# Altium project board_stm32h7.PrjPCB
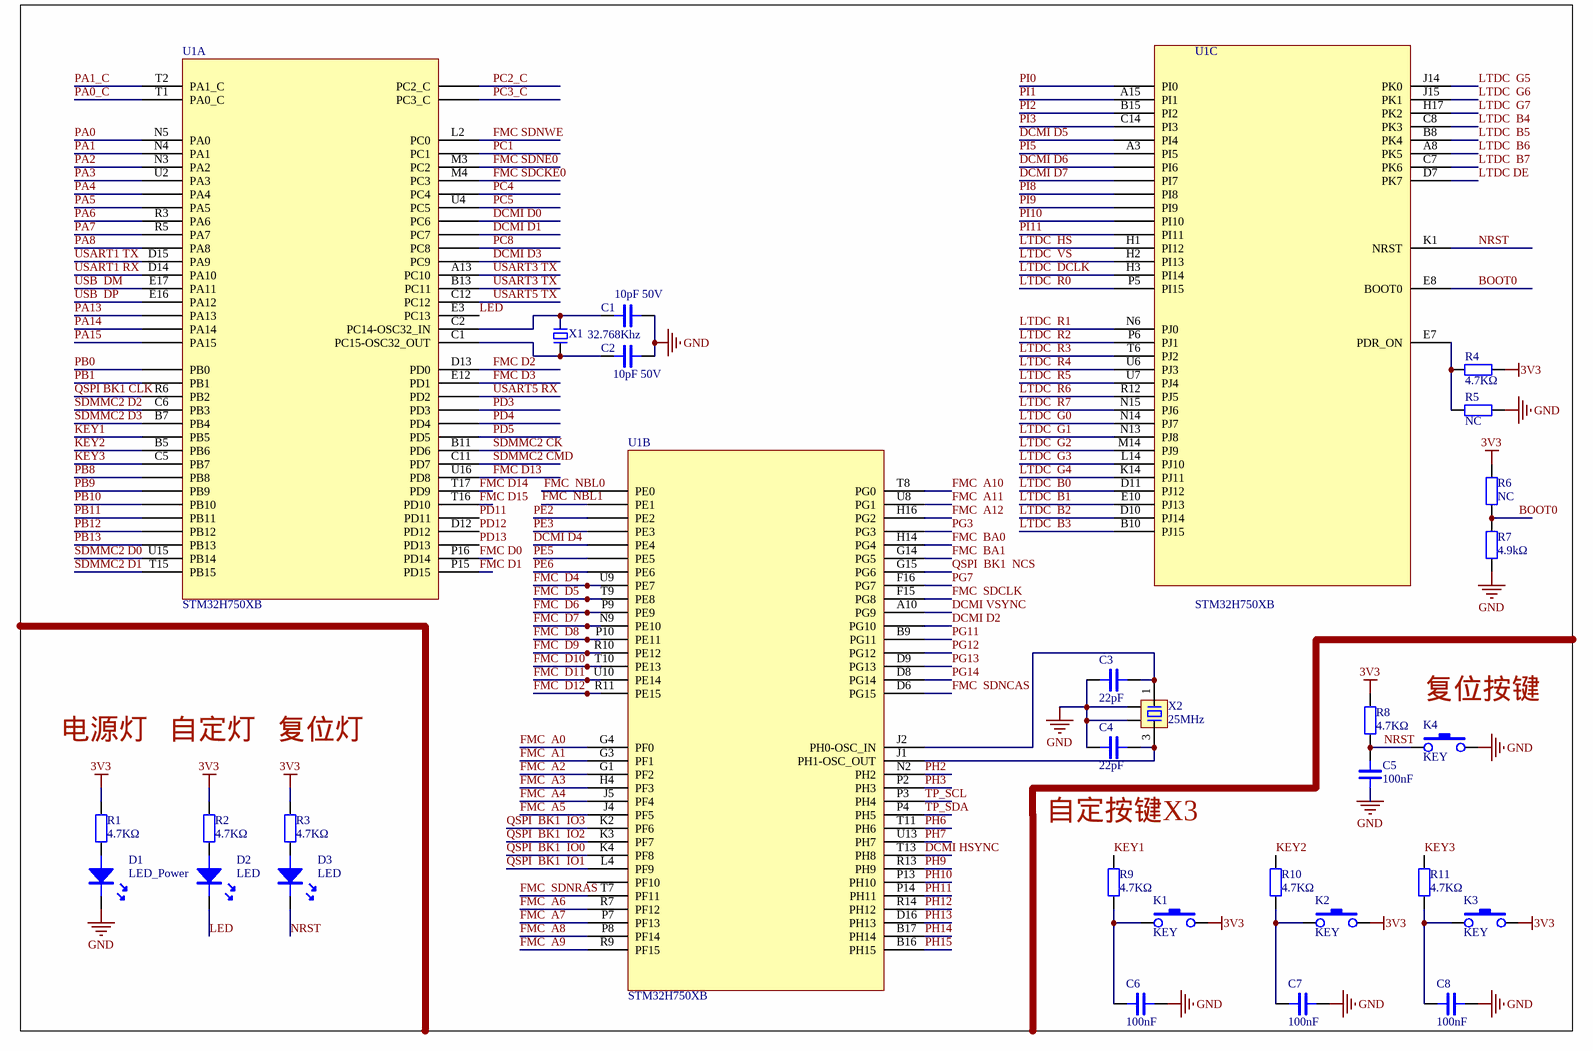
[diagram p0: STM32_PINS.SchDoc]
5 sheets, 109 parts. Net scope: global (net labels, ports and power ports of the same name join across sheets).
Board file: board_PCB.PcbDoc
Sheets:
  STM32_PINS.SchDoc
  stm32_vcc.SchDoc
  LCD.SchDoc
  Store.SchDoc
  INTERFACE.SchDoc

## Sheet STM32_PINS.SchDoc
size A4

### Parts
C1  10pF 50V  [0805C]
C2  10pF 50V  [0805C]
C3  22pF  [0805C]
C4  22pF  [0805C]
C5  100nF  [0805C]
C6  100nF  [0805C]
C7  100nF  [0805C]
C8  100nF  [0805C]
D1  LED_Power  [LED5-BLUE]
D2  LED  [LED5-BLUE]
D3  LED  [LED5-BLUE]
K1  KEY  [DIP-3X6X4.3]
K2  KEY  [DIP-3X6X4.3]
K3  KEY  [DIP-3X6X4.3]
K4  KEY  [DIP-3X6X4.3]
R1  4.7KΩ  [0805]
R2  4.7KΩ  [0805]
R3  4.7KΩ  [0805]
R4  4.7KΩ  [0805]
R5  NC  [0805]
R6  NC  [0805]
R7  4.9kΩ  [0805]
R8  4.7KΩ  [0805]
R9  4.7KΩ  [0805]
R10  4.7KΩ  [0805]
R11  4.7KΩ  [0805]
U1  STM32H750XB  [BGA265C80P17X17_1400X1400X110]  (parts A,B,C of 4)
X1  32.768Khz  [OSC HC-49S]
X2  25MHz  [OSC 1612-4P]

### Nets
3V3: K1.3 K2.3 K3.3 R1.2 R2.2 R3.2 R4.2 R6.2 R8.2
GND: C1.2 C2.1 C3.2 C4.2 C5.2 C6.1 C7.1 C8.1 D1.K K4.3 R5.2 R7.1 X2.2 X2.4  [project net LEDA]
BOOT0: R6.1 R7.2 U1.E8(BOOT0)
DCMI D0: U1.?18(PC6)
DCMI D1: U1.?19(PC7)
DCMI D2: U1.?10(PG10)
DCMI D3: U1.?21(PC9)
DCMI D4: U1.?5(PE4)
DCMI D5: U1.?2(PI4)
DCMI D6: U1.?3(PI6)
DCMI D7: U1.?4(PI7)
DCMI HSYNC: U1.T13(PH8)
DCMI VSYNC: U1.A10(PG9)
FMC  A0: U1.G4(PF0)
FMC  A1: U1.G3(PF1)
FMC  A2: U1.G1(PF2)
FMC  A3: U1.H4(PF3)
FMC  A4: U1.J5(PF4)
FMC  A5: U1.J4(PF5)
FMC  A6: U1.R7(PF12)
FMC  A7: U1.P7(PF13)
FMC  A8: U1.P8(PF14)
FMC  A9: U1.R9(PF15)
FMC  A10: U1.T8(PG0)
FMC  A11: U1.U8(PG1)
FMC  A12: U1.H16(PG2)
FMC  BA0: U1.H14(PG4)
FMC  BA1: U1.G14(PG5)
FMC  D4: U1.U9(PE7)
FMC  D5: U1.T9(PE8)
FMC  D6: U1.P9(PE9)
FMC  D7: U1.N9(PE10)
FMC  D8: U1.P10(PE11)
FMC  D9: U1.R10(PE12)
FMC  D10: U1.T10(PE13)
FMC  D11: U1.U10(PE14)
FMC  D12: U1.R11(PE15)
FMC  NBL0: U1.?1(PE0)
FMC  SDCLK: U1.F15(PG8)
FMC  SDNCAS: U1.D6(PG15)
FMC  SDNRAS: U1.T7(PF11)
FMC D0: U1.P16(PD14)
FMC D1: U1.P15(PD15)
FMC D2: U1.D13(PD0)
FMC D3: U1.E12(PD1)
FMC D13: U1.U16(PD8)
FMC D14: U1.T17(PD9)
FMC D15: U1.T16(PD10)
FMC SDCKE0: U1.M4(PC3)
FMC SDNE0: U1.M3(PC2)
FMC SDNWE: U1.L2(PC0)
KEY1: R9.1 U1.?9(PB5)
KEY2: R10.1 U1.B5(PB6)
KEY3: R11.1 U1.C5(PB7)
LED: D2.K U1.E3(PC13)
LTDC  B0: U1.D11(PJ12)
LTDC  B1: U1.E10(PJ13)
LTDC  B2: U1.D10(PJ14)
LTDC  B3: U1.B10(PJ15)
LTDC  B4: U1.C8(PK3)
LTDC  B5: U1.B8(PK4)
LTDC  B6: U1.A8(PK5)
LTDC  B7: U1.C7(PK6)
LTDC  DCLK: U1.H3(PI14)
LTDC  G0: U1.N14(PJ7)
LTDC  G1: U1.N13(PJ8)
LTDC  G2: U1.M14(PJ9)
LTDC  G3: U1.L14(PJ10)
LTDC  G4: U1.K14(PJ11)
LTDC  G5: U1.J14(PK0)
LTDC  G6: U1.J15(PK1)
LTDC  G7: U1.H17(PK2)
LTDC  HS: U1.H1(PI12)
LTDC  R0: U1.P5(PI15)
LTDC  R1: U1.N6(PJ0)
LTDC  R2: U1.P6(PJ1)
LTDC  R3: U1.T6(PJ2)
LTDC  R4: U1.U6(PJ3)
LTDC  R5: U1.U7(PJ4)
LTDC  R6: U1.R12(PJ5)
LTDC  R7: U1.N15(PJ6)
LTDC  VS: U1.H2(PI13)
LTDC DE: U1.D7(PK7)
NRST: C5.1 D3.K K4.1 R8.1 U1.K1(NRST)
PA0: U1.N5(PA0)
PA0_C: U1.T1(PA0_C)
PA1: U1.N4(PA1)
PA1_C: U1.T2(PA1_C)
PA2: U1.N3(PA2)
PA3: U1.U2(PA3)
PA4: U1.?1(PA4)
PA5: U1.?2(PA5)
PA6: U1.R3(PA6)
PA7: U1.R5(PA7)
PA8: U1.?3(PA8)
PA13: U1.?4(PA13)
PA14: U1.?5(PA14)
PA15: U1.?6(PA15)
PB0: U1.?7(PB0)
PB1: U1.?8(PB1)
PB8: U1.?10(PB8)
PB9: U1.?11(PB9)
PB10: U1.?12(PB10)
PB11: U1.?13(PB11)
PB12: U1.?14(PB12)
PB13: U1.?15(PB13)
PC1: U1.?16(PC1)
PC2_C: U1.?28(PC2_C)
PC3_C: U1.?29(PC3_C)
PC4: U1.?17(PC4)
PC5: U1.U4(PC5)
PC8: U1.?20(PC8)
PD3: U1.?23(PD3)
PD4: U1.?24(PD4)
PD5: U1.?25(PD5)
PD11: U1.?26(PD11)
PD12: U1.D12(PD12)
PD13: U1.?27(PD13)
PE2: U1.?3(PE2)
PE3: U1.?4(PE3)
PE5: U1.?6(PE5)
PE6: U1.?7(PE6)
PG3: U1.?9(PG3)
PG7: U1.F16(PG7)
PG11: U1.B9(PG11)
PG12: U1.?11(PG12)
PG13: U1.D9(PG13)
PG14: U1.D8(PG14)
PH2: U1.N2(PH2)
PH3: U1.P2(PH3)
PH6: U1.T11(PH6)
PH7: U1.U13(PH7)
PH9: U1.R13(PH9)
PH10: U1.P13(PH10)
PH11: U1.P14(PH11)
PH12: U1.R14(PH12)
PH13: U1.D16(PH13)
PH14: U1.B17(PH14)
PH15: U1.B16(PH15)
PI0: U1.?1(PI0)
PI1: U1.A15(PI1)
PI2: U1.B15(PI2)
PI3: U1.C14(PI3)
PI5: U1.A3(PI5)
PI8: U1.?5(PI8)
PI9: U1.?6(PI9)
PI10: U1.?7(PI10)
PI11: U1.?8(PI11)
QSPI  BK1  IO0: U1.K4(PF8)
QSPI  BK1  IO1: U1.L4(PF9)
QSPI  BK1  IO2: U1.K3(PF7)
QSPI  BK1  IO3: U1.K2(PF6)
QSPI  BK1  NCS: U1.G15(PG6)
QSPI BK1 CLK: U1.R6(PB2)
SDMMC2 CK: U1.B11(PD6)
SDMMC2 CMD: U1.C11(PD7)
SDMMC2 D0: U1.U15(PB14)
SDMMC2 D1: U1.T15(PB15)
SDMMC2 D2: U1.C6(PB3)
SDMMC2 D3: U1.B7(PB4)
TP_SCL: U1.P3(PH4)
TP_SDA: U1.P4(PH5)
USART1 RX: U1.D14(PA10)
USART1 TX: U1.D15(PA9)
USART3 TX: U1.A13(PC10) U1.B13(PC11)
USART5 RX: U1.?22(PD2)
USART5 TX: U1.C12(PC12)
USB  DM: U1.E17(PA11)
USB  DP: U1.E16(PA12)
NetC1_1: C1.1 U1.C2(PC14-OSC32_IN) X1.2
NetC2_2: C2.2 U1.C1(PC15-OSC32_OUT) X1.1
NetC3_1: C3.1 U1.J2(PH0-OSC_IN) X2.1
NetC4_1: C4.1 U1.J1(PH1-OSC_OUT) X2.3
NetC6_2: C6.2 K1.1 R9.2
NetC7_2: C7.2 K2.1 R10.2
NetC8_2: C8.2 K3.1 R11.2
NetR4_1: R4.1 R5.1 U1.E7(PDR_ON)

Not connected (* = marked no-connect by the designer): D1 A; D2 A; D3 A; R1 1; R2 1; R3 1

### Notes on the sheet
- 复位按键
- 电源灯
- 自定灯
- 复位灯
- 自定按键X3
- Labels drawn without touching a wire or pin: FMC  NBL1

### Library data of the parts
C1-C8 = CAP: Capacitor
D1 = LED
R1-R11 = RES: Resistor
X1 = XTAL-2P: 2脚无源脚晶振
X2 = XTAL-4P: 4脚无源晶振

## Sheet stm32_vcc.SchDoc
size A4
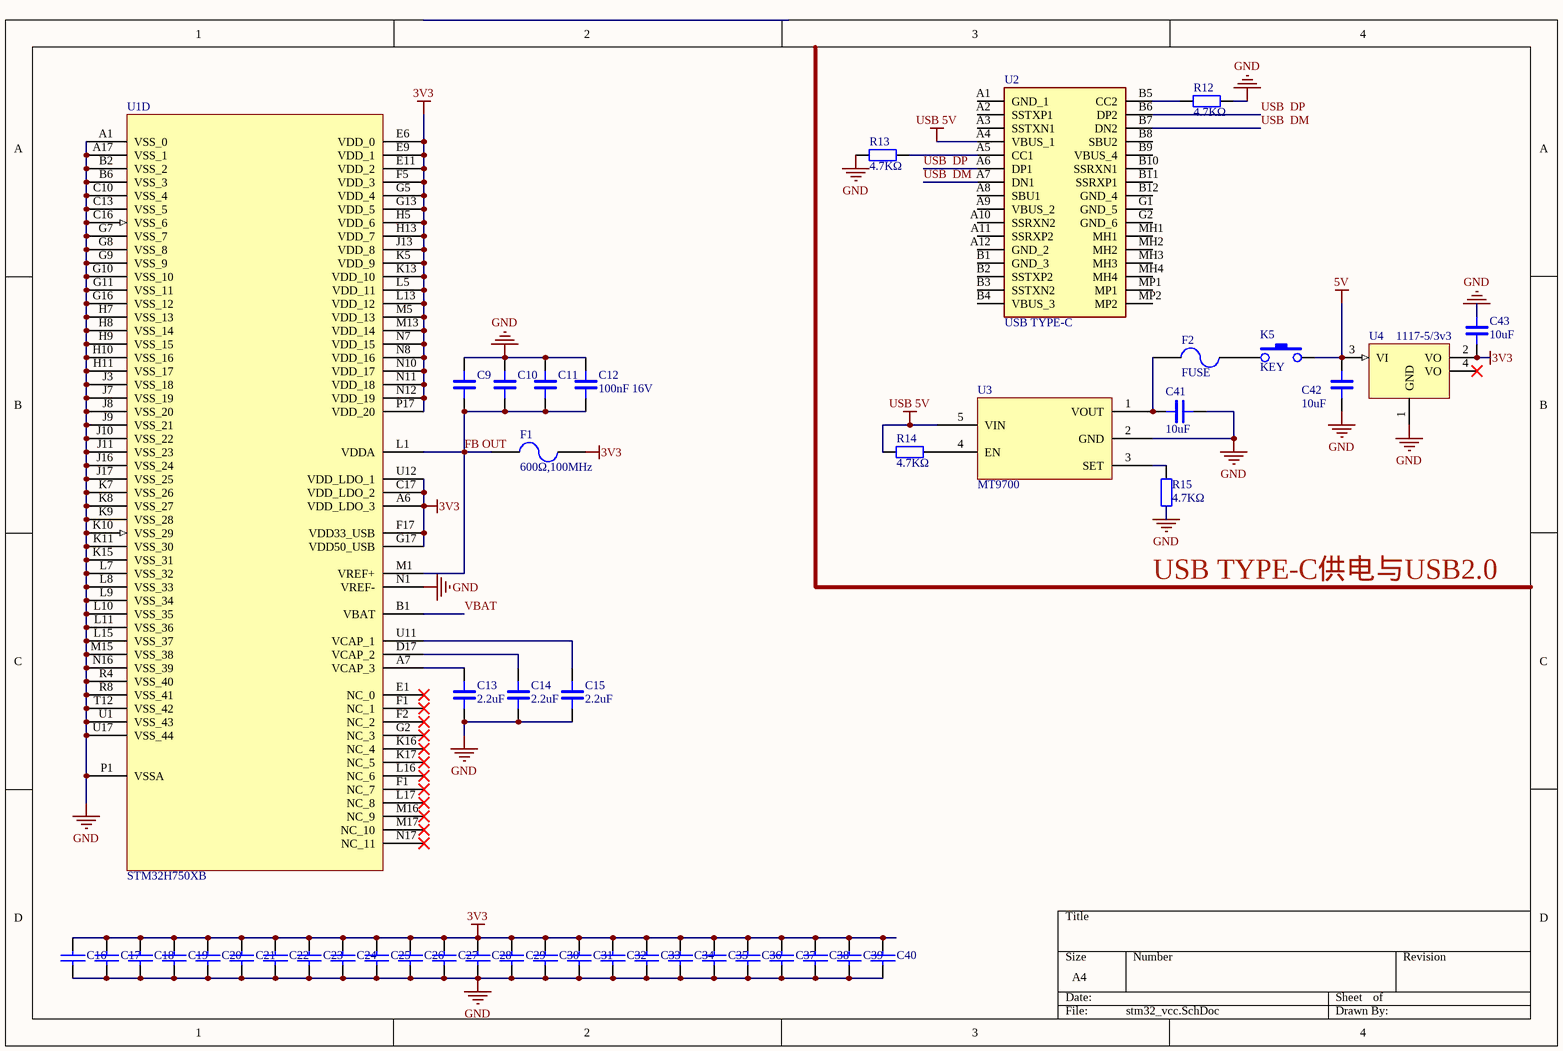
[diagram p1: stm32_vcc.SchDoc]

### Parts
C9  100nF 16V  [0805]  (value not drawn)
C10  100nF 16V  [0805]  (value not drawn)
C11  100nF 16V  [0805]  (value not drawn)
C12  100nF 16V  [0805]
C13  2.2uF  [0805]
C14  2.2uF  [0805]
C15  2.2uF  [0805]
C16  104 16V  [0805C]  (value not drawn)
C17  104 16V  [0805C]  (value not drawn)
C18  104 16V  [0805C]  (value not drawn)
C19  104 16V  [0805C]  (value not drawn)
C20  104 16V  [0805C]  (value not drawn)
C21  104 16V  [0805C]  (value not drawn)
C22  104 16V  [0805C]  (value not drawn)
C23  104 16V  [0805C]  (value not drawn)
C24  104 16V  [0805C]  (value not drawn)
C25  104 16V  [0805C]  (value not drawn)
C26  104 16V  [0805C]  (value not drawn)
C27  104 16V  [0805C]  (value not drawn)
C28  104 16V  [0805C]  (value not drawn)
C29  104 16V  [0805C]  (value not drawn)
C30  104 16V  [0805C]  (value not drawn)
C31  104 16V  [0805C]  (value not drawn)
C32  104 16V  [0805C]  (value not drawn)
C33  104 16V  [0805C]  (value not drawn)
C34  104 16V  [0805C]  (value not drawn)
C35  104 16V  [0805C]  (value not drawn)
C36  104 16V  [0805C]  (value not drawn)
C37  104 16V  [0805C]  (value not drawn)
C38  104 16V  [0805C]  (value not drawn)
C39  104 16V  [0805C]  (value not drawn)
C40  104 16V  [0805C]  (value not drawn)
C41  10uF  [0805]
C42  10uF  [0805]
C43  10uF  [CAP-0805]
F1  600Ω,100MHz  [FUSE-1210]
F2  FUSE  [FUSE-1210]
K5  KEY  [DIP-3X6X4.3]
R12  4.7KΩ  [0805]
R13  4.7KΩ  [0805]
R14  4.7KΩ  [0805]
R15  4.7KΩ  [0805]
U1  STM32H750XB  [BGA265C80P17X17_1400X1400X110]  (part D of 4)
U2  USB TYPE-C  [632723100011]
U3  MT9700  [SOT-23-5]
U4  1117-5/3v3  [SOT-23]

### Nets
3V3: C16.2 C17.2 C18.2 C19.2 C20.2 C21.2 C22.2 C23.2 C24.2 C25.2 C26.2 C27.2 C28.2 C29.2 C30.2 C31.2 C32.2 C33.2 C34.2 C35.2 C36.2 C37.2 C38.2 C39.2 C40.2 C43.2 F1.2 U1.A6(VDD_LDO_3) U1.C17(VDD_LDO_2) U1.E6(VDD_0) U1.E9(VDD_1) U1.E11(VDD_2) U1.F5(VDD_3) U1.F17(VDD33_USB) U1.G5(VDD_4) U1.G13(VDD_5) U1.G17(VDD50_USB) U1.H5(VDD_6) U1.H13(VDD_7) U1.J13(VDD_8) U1.K5(VDD_9) U1.K13(VDD_10) U1.L5(VDD_11) U1.L13(VDD_12) U1.M5(VDD_13) U1.M13(VDD_14) U1.N7(VDD_15) U1.N8(VDD_16) U1.N10(VDD_17) U1.N11(VDD_18) U1.N12(VDD_19) U1.P17(VDD_20) U1.U12(VDD_LDO_1) U4.2(VO)
5V: C42.1 K5.3 U4.3(VI)
GND: C9.2 C10.2 C11.2 C12.2 C13.1 C14.1 C15.1 C16.1 C17.1 C18.1 C19.1 C20.1 C21.1 C22.1 C23.1 C24.1 C25.1 C26.1 C27.1 C28.1 C29.1 C30.1 C31.1 C32.1 C33.1 C34.1 C35.1 C36.1 C37.1 C38.1 C39.1 C40.1 C41.1 C42.2 C43.1 R12.1 R13.2 R15.2 U1.A1(VSS_0) U1.A17(VSS_1) U1.B2(VSS_2) U1.B6(VSS_3) U1.C10(VSS_4) U1.C13(VSS_5) U1.C16(VSS_6) U1.G7(VSS_7) U1.G8(VSS_8) U1.G9(VSS_9) U1.G10(VSS_10) U1.G11(VSS_11) U1.G16(VSS_12) U1.H7(VSS_13) U1.H8(VSS_14) U1.H9(VSS_15) U1.H10(VSS_16) U1.H11(VSS_17) U1.J3(VSS_18) U1.J7(VSS_19) U1.J8(VSS_20) U1.J9(VSS_21) U1.J10(VSS_22) U1.J11(VSS_23) U1.J16(VSS_24) U1.J17(VSS_25) U1.K7(VSS_26) U1.K8(VSS_27) U1.K9(VSS_28) U1.K10(VSS_29) U1.K11(VSS_30) U1.K15(VSS_31) U1.L7(VSS_32) U1.L8(VSS_33) U1.L9(VSS_34) U1.L10(VSS_35) U1.L11(VSS_36) U1.L15(VSS_37) U1.M15(VSS_38) U1.N1(VREF-) U1.N16(VSS_39) U1.P1(VSSA) U1.R4(VSS_40) U1.R8(VSS_41) U1.T12(VSS_42) U1.U1(VSS_43) U1.U17(VSS_44) U3.2(GND) U4.1(GND)  [project net LEDA]
USB 5V: R14.2 U2.A4(VBUS_1) U3.5(VIN)
FB OUT: C9.1 C10.1 C11.1 C12.1 F1.1 U1.L1(VDDA) U1.M1(VREF+)
USB  DM: U2.A7(DN1) U2.B7(DN2)
USB  DP: U2.A6(DP1) U2.B6(DP2)
VBAT: U1.B1(VBAT)
NetC13_2: C13.2 U1.A7(VCAP_3)
NetC14_2: C14.2 U1.D17(VCAP_2)
NetC15_2: C15.2 U1.U11(VCAP_1)
NetC41_2: C41.2 F2.1 U3.1(VOUT)
NetF2_2: F2.2 K5.1
NetR12_2: R12.2 U2.B5(CC2)
NetR13_1: R13.1 U2.A5(CC1)
NetR14_1: R14.1 U3.4(EN)
NetR15_1: R15.1 U3.3(SET)

Not connected (* = marked no-connect by the designer): U1 E1(NC_0)* F1(NC_1)* F2(NC_2)* G2(NC_3)* K16(NC_4)* K17(NC_5)* L16(NC_6)* L17(NC_8)* M16(NC_9)* M17(NC_10)* N17(NC_11)*; U2 A1(GND_1) A2(SSTXP1) A3(SSTXN1) A8(SBU1) A9(VBUS_2) A10(SSRXN2) A11(SSRXP2) A12(GND_2) B1(GND_3) B2(SSTXP2) B3(SSTXN2) B4(VBUS_3) B8(SBU2) B9(VBUS_4) B10(SSRXN1) B11(SSRXP1) B12(GND_4) G1(GND_5) G2(GND_6) MH1 MH2 MH3 MH4 MP1 MP2; U4 4(VO)*

### Notes on the sheet
- (near R15) USB TYPE-C供电与USB2.0

### Library data of the parts
C9-C15 C41-C43 = CAP: Capacitor
C16-C40 = CAP: 无极性电容
F1 = FUSE
F2 = FUSE: 1000mA
R12-R15 = RES: Resistor
U2 = 632723100011: Integrated Circuit; Manufacturer_Name: Wurth Elektronik; Datasheet Link: https://componentsearchengine.com/Datasheets/1/632723100011.pdf; Height: 3.11mm; Manufacturer_Part_Number: 632723100011; Mouser Part Number: 710-632723100011; Mouser Price/Stock: https://www.mouser.co.uk/ProductDetail/Wurth-Elektronik/632723100011?qs=NK6InXoXhq4o62C9ULXLjQ%3D%3D
U4 = 1117: Linear Regulator

## Sheet LCD.SchDoc
size A4
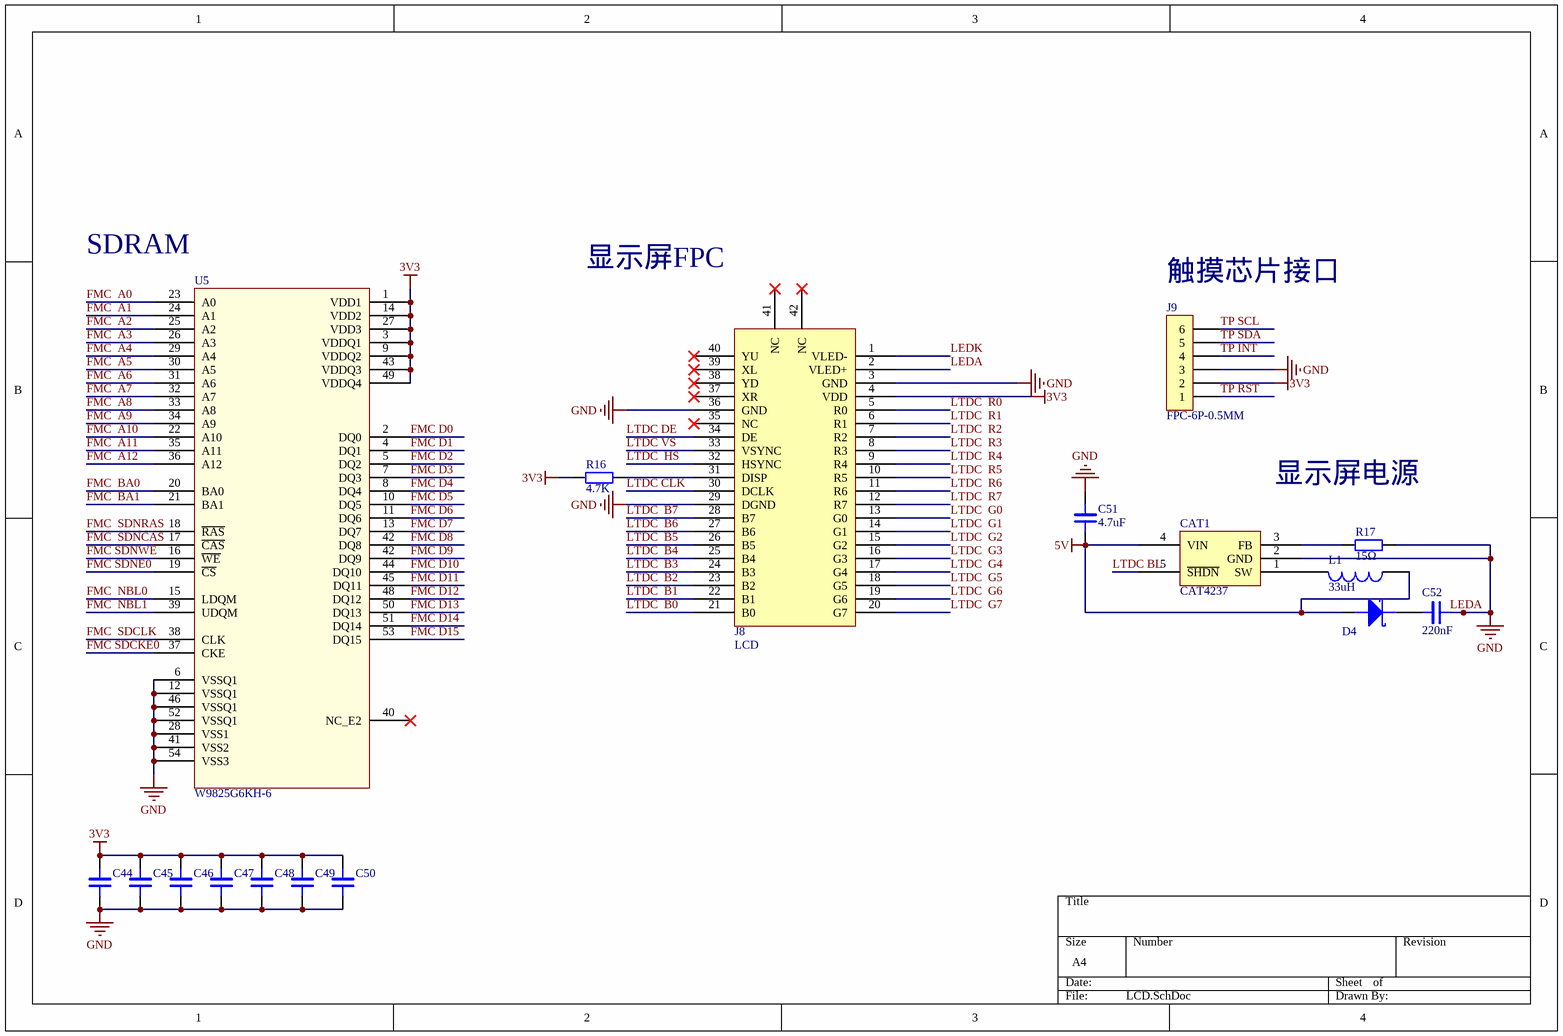
[diagram p2: LCD.SchDoc]

### Parts
C44  100nF 16V  [0805]  (value not drawn)
C45  100nF 16V  [0805]  (value not drawn)
C46  100nF 16V  [0805]  (value not drawn)
C47  100nF 16V  [0805]  (value not drawn)
C48  100nF 16V  [0805]  (value not drawn)
C49  100nF 16V  [0805]  (value not drawn)
C50  100nF 16V  [0805]  (value not drawn)
C51  4.7uF  [CAP-1812]
C52  220nF  [CAP-1812]
CAT1  CAT4237  [SOT-23-5]
D4  (no value)  [DO-15]
J8  LCD
J9  FPC-6P-0.5MM  [Pin HDR1X6/2.54mm-S]
L1  33uH  [AL0204]
R16  4.7K  [0805]
R17  15Ω  [0805]
U5  W9825G6KH-6

### Nets
3V3: C44.2 C45.2 C46.2 C47.2 C48.2 C49.2 C50.2 J8.4(VDD) J9.2 R16.1 U5.1(VDD1) U5.3(VDDQ1) U5.9(VDDQ2) U5.14(VDD2) U5.27(VDD3) U5.43(VDDQ3) U5.49(VDDQ4)
5V: C51.1 CAT1.4(VIN) D4.A L1.1
LEDA: C44.1 C45.1 C46.1 C47.1 C48.1 C49.1 C50.1 C51.2 C52.2 CAT1.2(GND) J8.2(VLED+) J8.3(GND) J8.29(DGND) J8.36(GND) J9.3 R17.2 U5.6(VSSQ1) U5.12(VSSQ1) U5.28(VSS1) U5.41(VSS2) U5.46(VSSQ1) U5.52(VSSQ1) U5.54(VSS3)  [also labelled GND]
FMC  A0: U5.23(A0)
FMC  A1: U5.24(A1)
FMC  A2: U5.25(A2)
FMC  A3: U5.26(A3)
FMC  A4: U5.29(A4)
FMC  A5: U5.30(A5)
FMC  A6: U5.31(A6)
FMC  A7: U5.32(A7)
FMC  A8: U5.33(A8)
FMC  A9: U5.34(A9)
FMC  A10: U5.22(A10)
FMC  A11: U5.35(A11)
FMC  A12: U5.36(A12)
FMC  BA0: U5.20(BA0)
FMC  BA1: U5.21(BA1)
FMC  NBL0: U5.15(LDQM)
FMC  NBL1: U5.39(UDQM)
FMC  SDCLK: U5.38(CLK)
FMC  SDNCAS: U5.17(~{CAS})
FMC  SDNRAS: U5.18(~{RAS})
FMC D0: U5.2(DQ0)
FMC D1: U5.4(DQ1)
FMC D2: U5.5(DQ2)
FMC D3: U5.7(DQ3)
FMC D4: U5.8(DQ4)
FMC D5: U5.10(DQ5)
FMC D6: U5.11(DQ6)
FMC D7: U5.13(DQ7)
FMC D8: U5.42(DQ8)
FMC D9: U5.42(DQ9)
FMC D10: U5.44(DQ10)
FMC D11: U5.45(DQ11)
FMC D12: U5.48(DQ12)
FMC D13: U5.50(DQ13)
FMC D14: U5.51(DQ14)
FMC D15: U5.53(DQ15)
FMC SDCKE0: U5.37(CKE)
FMC SDNE0: U5.19(~{CS})
FMC SDNWE: U5.16(~{WE})
LEDK: J8.1(VLED-)
LTDC  B0: J8.21(B0)
LTDC  B1: J8.22(B1)
LTDC  B2: J8.23(B2)
LTDC  B3: J8.24(B3)
LTDC  B4: J8.25(B4)
LTDC  B5: J8.26(B5)
LTDC  B6: J8.27(B6)
LTDC  B7: J8.28(B7)
LTDC  G0: J8.13(G0)
LTDC  G1: J8.14(G1)
LTDC  G2: J8.15(G2)
LTDC  G3: J8.16(G3)
LTDC  G4: J8.17(G4)
LTDC  G5: J8.18(G5)
LTDC  G6: J8.19(G6)
LTDC  G7: J8.20(G7)
LTDC  HS: J8.32(HSYNC)
LTDC  R0: J8.5(R0)
LTDC  R1: J8.6(R1)
LTDC  R2: J8.7(R2)
LTDC  R3: J8.8(R3)
LTDC  R4: J8.9(R4)
LTDC  R5: J8.10(R5)
LTDC  R6: J8.11(R6)
LTDC  R7: J8.12(R7)
LTDC BL: CAT1.5(~{SHDN})
LTDC CLK: J8.30(DCLK)
LTDC DE: J8.34(DE)
LTDC VS: J8.33(VSYNC)
TP INT: J9.4
TP RST: J9.1
TP SCL: J9.6
TP SDA: J9.5
NetC52_1: C52.1 D4.K
NetCAT1_1: CAT1.1(SW) L1.2
NetCAT1_3: CAT1.3(FB) R17.1
NetJ8_31: J8.31(DISP) R16.2

Not connected (* = marked no-connect by the designer): J8 35(NC)* 37(XR)* 38(YD)* 39(XL)* 40(YU)* 41(NC)* 42(NC)*; U5 40(NC_E2)*

### Notes on the sheet
- (near U5) SDRAM
- 显示屏FPC
- (near J9) 触摸芯片接口
- 显示屏电源

### Library data of the parts
C44-C52 = CAP: Capacitor
D4 = DIODE SCHOTTKY: 肖特基二极管
J8 = LCD: FPC 接线口0.5mm 40Pins
J9 = Pin HDR1X6
L1 = INDUCTOR
R16 R17 = RES: Resistor

## Sheet Store.SchDoc
size A4
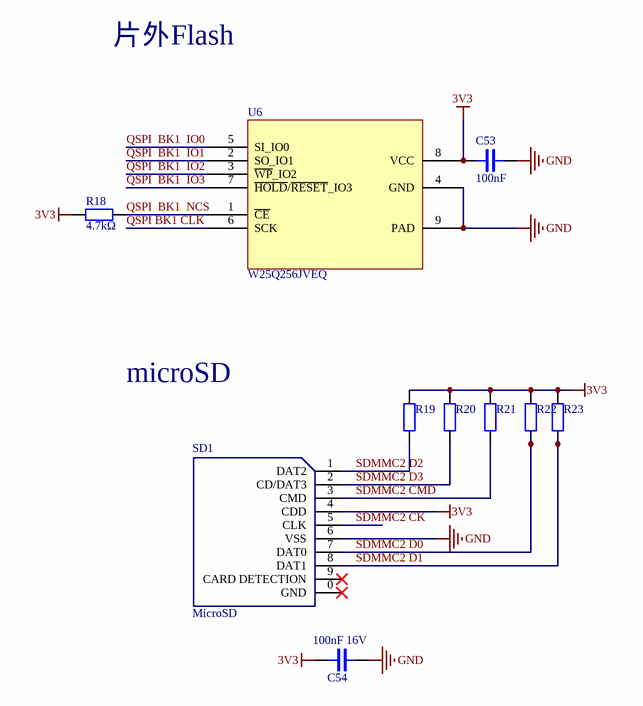
[diagram p3: Store.SchDoc]

### Parts
C53  100nF  [0805]
C54  100nF 16V  [CAP-1812]
R18  4.7kΩ  [0805]
R19  10kΩ  [0805]  (value not drawn)
R20  10kΩ  [0805]  (value not drawn)
R21  10kΩ  [0805]  (value not drawn)
R22  10kΩ  [0805]  (value not drawn)
R23  10kΩ  [0805]  (value not drawn)
SD1  MicroSD  [Micro SD]
U6  W25Q256JVEQ

### Nets
3V3: C53.1 C54.2 R18.1 R19.2 R20.2 R21.2 R22.2 R23.2 SD1.4(CDD) U6.8(VCC)
GND: C53.2 C54.1 SD1.6(VSS) U6.4(GND) U6.9(PAD)  [project net LEDA]
QSPI  BK1  IO0: U6.5(SI_IO0)
QSPI  BK1  IO1: U6.2(SO_IO1)
QSPI  BK1  IO2: U6.3(~{WP}_IO2)
QSPI  BK1  IO3: U6.7(~{HOLD}/~{RESET}_IO3)
QSPI  BK1  NCS: R18.2 U6.1(~{CE})
QSPI BK1 CLK: U6.6(SCK)
SDMMC2 CK: SD1.5(CLK)
SDMMC2 CMD: R21.1 SD1.3(CMD)
SDMMC2 D0: R22.1 SD1.7(DAT0)
SDMMC2 D1: R23.1 SD1.8(DAT1)
SDMMC2 D2: R19.1 SD1.1(DAT2)
SDMMC2 D3: R20.1 SD1.2(CD/DAT3)

Not connected (* = marked no-connect by the designer): SD1 0(GND)* 9(CARD_DETECTION)*

### Notes on the sheet
- 片外Flash
- microSD

### Library data of the parts
C53 C54 = CAP: Capacitor
R18-R23 = RES: Resistor

## Sheet INTERFACE.SchDoc
size A4
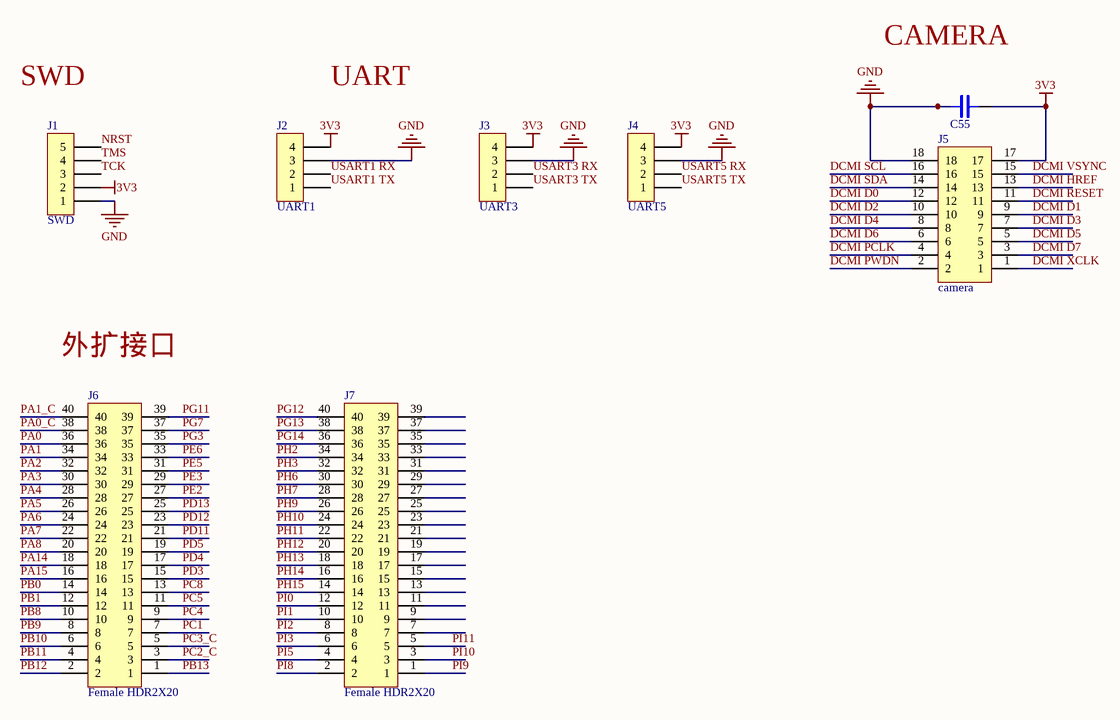
[diagram p4: INTERFACE.SchDoc]

### Parts
C55  104  [CAP-1812]  (value not drawn)
J1  SWD  [Pin HDR1X5/2mm-W]
J2  UART1  [Fe-HDR1X4/2.54-S]
J3  UART3  [Fe-HDR1X4/2.54-S]
J4  UART5  [Fe-HDR1X4/2.54-S]
J5  camera  [Fe-HDR2X9/2.54-S]
J6  Female HDR2X20  [Fe-HDR2X20/2.54-S]
J7  Female HDR2X20  [Fe-HDR2X20/2.54-S]

### Nets
3V3: C55.1 J1.2 J2.4 J3.4 J4.4 J5.17
GND: C55.2 J1.1 J2.3 J3.3 J4.3 J5.18  [project net LEDA]
DCMI D0: J5.12
DCMI D1: J5.9
DCMI D2: J5.10
DCMI D3: J5.7
DCMI D4: J5.8
DCMI D5: J5.5
DCMI D6: J5.6
DCMI D7: J5.3
DCMI HREF: J5.13
DCMI PCLK: J5.4
DCMI PWDN: J5.2
DCMI RESET: J5.11
DCMI SCL: J5.16
DCMI SDA: J5.14
DCMI VSYNC: J5.15
DCMI XCLK: J5.1
NRST: J1.5
PA0: J6.36
PA0_C: J6.38
PA1: J6.34
PA1_C: J6.40
PA2: J6.32
PA3: J6.30
PA4: J6.28
PA5: J6.26
PA6: J6.24
PA7: J6.22
PA8: J6.20
PA14: J6.18
PA15: J6.16
PB0: J6.14
PB1: J6.12
PB8: J6.10
PB9: J6.8
PB10: J6.6
PB11: J6.4
PB12: J6.2
PB13: J6.1
PC1: J6.7
PC2_C: J6.3
PC3_C: J6.5
PC4: J6.9
PC5: J6.11
PC8: J6.13
PD3: J6.15
PD4: J6.17
PD5: J6.19
PD11: J6.21
PD12: J6.23
PD13: J6.25
PE2: J6.27
PE3: J6.29
PE5: J6.31
PE6: J6.33
PG3: J6.35
PG7: J6.37
PG11: J6.39
PG12: J7.40
PG13: J7.38
PG14: J7.36
PH2: J7.34
PH3: J7.32
PH6: J7.30
PH7: J7.28
PH9: J7.26
PH10: J7.24
PH11: J7.22
PH12: J7.20
PH13: J7.18
PH14: J7.16
PH15: J7.14
PI0: J7.12
PI1: J7.10
PI2: J7.8
PI3: J7.6
PI5: J7.4
PI8: J7.2
PI9: J7.1
PI10: J7.3
PI11: J7.5
TCK: J1.3
TMS: J1.4
USART1 RX: J2.2
USART1 TX: J2.1
USART3 RX: J3.2
USART3 TX: J3.1
USART5 RX: J4.2
USART5 TX: J4.1

Not connected (* = marked no-connect by the designer): J7 7 9 11 13 15 17 19 21 23 25 27 29 31 33 35 37 39

### Notes on the sheet
- SWD
- UART
- CAMERA
- 外扩接口

### Library data of the parts
C55 = CAP: Capacitor
J1 = Pin HDR1X5
J2-J4 = Female HDR1X4
J5 = Female HDR2X9

## Nets that join several sheets
3V3: STM32_PINS (9 pins), stm32_vcc (54 pins), LCD (17 pins), Store (10 pins), INTERFACE (6 pins)
5V: stm32_vcc (C42.1 K5.3 U4.3), LCD (C51.1 CAT1.4 D4.A L1.1)
LEDA: STM32_PINS (14 pins), stm32_vcc (87 pins), LCD (23 pins), Store (5 pins), INTERFACE (6 pins)
DCMI D0: STM32_PINS (U1.?18), INTERFACE (J5.12)
DCMI D1: STM32_PINS (U1.?19), INTERFACE (J5.9)
DCMI D2: STM32_PINS (U1.?10), INTERFACE (J5.10)
DCMI D3: STM32_PINS (U1.?21), INTERFACE (J5.7)
DCMI D4: STM32_PINS (U1.?5), INTERFACE (J5.8)
DCMI D5: STM32_PINS (U1.?2), INTERFACE (J5.5)
DCMI D6: STM32_PINS (U1.?3), INTERFACE (J5.6)
DCMI D7: STM32_PINS (U1.?4), INTERFACE (J5.3)
DCMI VSYNC: STM32_PINS (U1.A10), INTERFACE (J5.15)
FMC  A0: STM32_PINS (U1.G4), LCD (U5.23)
FMC  A1: STM32_PINS (U1.G3), LCD (U5.24)
FMC  A2: STM32_PINS (U1.G1), LCD (U5.25)
FMC  A3: STM32_PINS (U1.H4), LCD (U5.26)
FMC  A4: STM32_PINS (U1.J5), LCD (U5.29)
FMC  A5: STM32_PINS (U1.J4), LCD (U5.30)
FMC  A6: STM32_PINS (U1.R7), LCD (U5.31)
FMC  A7: STM32_PINS (U1.P7), LCD (U5.32)
FMC  A8: STM32_PINS (U1.P8), LCD (U5.33)
FMC  A9: STM32_PINS (U1.R9), LCD (U5.34)
FMC  A10: STM32_PINS (U1.T8), LCD (U5.22)
FMC  A11: STM32_PINS (U1.U8), LCD (U5.35)
FMC  A12: STM32_PINS (U1.H16), LCD (U5.36)
FMC  BA0: STM32_PINS (U1.H14), LCD (U5.20)
FMC  BA1: STM32_PINS (U1.G14), LCD (U5.21)
FMC  NBL0: STM32_PINS (U1.?1), LCD (U5.15)
FMC  SDCLK: STM32_PINS (U1.F15), LCD (U5.38)
FMC  SDNCAS: STM32_PINS (U1.D6), LCD (U5.17)
FMC  SDNRAS: STM32_PINS (U1.T7), LCD (U5.18)
FMC D0: STM32_PINS (U1.P16), LCD (U5.2)
FMC D1: STM32_PINS (U1.P15), LCD (U5.4)
FMC D2: STM32_PINS (U1.D13), LCD (U5.5)
FMC D3: STM32_PINS (U1.E12), LCD (U5.7)
FMC D13: STM32_PINS (U1.U16), LCD (U5.50)
FMC D14: STM32_PINS (U1.T17), LCD (U5.51)
FMC D15: STM32_PINS (U1.T16), LCD (U5.53)
FMC SDCKE0: STM32_PINS (U1.M4), LCD (U5.37)
FMC SDNE0: STM32_PINS (U1.M3), LCD (U5.19)
FMC SDNWE: STM32_PINS (U1.L2), LCD (U5.16)
LTDC  B0: STM32_PINS (U1.D11), LCD (J8.21)
LTDC  B1: STM32_PINS (U1.E10), LCD (J8.22)
LTDC  B2: STM32_PINS (U1.D10), LCD (J8.23)
LTDC  B3: STM32_PINS (U1.B10), LCD (J8.24)
LTDC  B4: STM32_PINS (U1.C8), LCD (J8.25)
LTDC  B5: STM32_PINS (U1.B8), LCD (J8.26)
LTDC  B6: STM32_PINS (U1.A8), LCD (J8.27)
LTDC  B7: STM32_PINS (U1.C7), LCD (J8.28)
LTDC  G0: STM32_PINS (U1.N14), LCD (J8.13)
LTDC  G1: STM32_PINS (U1.N13), LCD (J8.14)
LTDC  G2: STM32_PINS (U1.M14), LCD (J8.15)
LTDC  G3: STM32_PINS (U1.L14), LCD (J8.16)
LTDC  G4: STM32_PINS (U1.K14), LCD (J8.17)
LTDC  G5: STM32_PINS (U1.J14), LCD (J8.18)
LTDC  G6: STM32_PINS (U1.J15), LCD (J8.19)
LTDC  G7: STM32_PINS (U1.H17), LCD (J8.20)
LTDC  HS: STM32_PINS (U1.H1), LCD (J8.32)
LTDC  R0: STM32_PINS (U1.P5), LCD (J8.5)
LTDC  R1: STM32_PINS (U1.N6), LCD (J8.6)
LTDC  R2: STM32_PINS (U1.P6), LCD (J8.7)
LTDC  R3: STM32_PINS (U1.T6), LCD (J8.8)
LTDC  R4: STM32_PINS (U1.U6), LCD (J8.9)
LTDC  R5: STM32_PINS (U1.U7), LCD (J8.10)
LTDC  R6: STM32_PINS (U1.R12), LCD (J8.11)
LTDC  R7: STM32_PINS (U1.N15), LCD (J8.12)
LTDC DE: STM32_PINS (U1.D7), LCD (J8.34)
NRST: STM32_PINS (5 pins), INTERFACE (J1.5)
PA0: STM32_PINS (U1.N5), INTERFACE (J6.36)
PA0_C: STM32_PINS (U1.T1), INTERFACE (J6.38)
PA1: STM32_PINS (U1.N4), INTERFACE (J6.34)
PA1_C: STM32_PINS (U1.T2), INTERFACE (J6.40)
PA2: STM32_PINS (U1.N3), INTERFACE (J6.32)
PA3: STM32_PINS (U1.U2), INTERFACE (J6.30)
PA4: STM32_PINS (U1.?1), INTERFACE (J6.28)
PA5: STM32_PINS (U1.?2), INTERFACE (J6.26)
PA6: STM32_PINS (U1.R3), INTERFACE (J6.24)
PA7: STM32_PINS (U1.R5), INTERFACE (J6.22)
PA8: STM32_PINS (U1.?3), INTERFACE (J6.20)
PA14: STM32_PINS (U1.?5), INTERFACE (J6.18)
PA15: STM32_PINS (U1.?6), INTERFACE (J6.16)
PB0: STM32_PINS (U1.?7), INTERFACE (J6.14)
PB1: STM32_PINS (U1.?8), INTERFACE (J6.12)
PB8: STM32_PINS (U1.?10), INTERFACE (J6.10)
PB9: STM32_PINS (U1.?11), INTERFACE (J6.8)
PB10: STM32_PINS (U1.?12), INTERFACE (J6.6)
PB11: STM32_PINS (U1.?13), INTERFACE (J6.4)
PB12: STM32_PINS (U1.?14), INTERFACE (J6.2)
PB13: STM32_PINS (U1.?15), INTERFACE (J6.1)
PC1: STM32_PINS (U1.?16), INTERFACE (J6.7)
PC2_C: STM32_PINS (U1.?28), INTERFACE (J6.3)
PC3_C: STM32_PINS (U1.?29), INTERFACE (J6.5)
PC4: STM32_PINS (U1.?17), INTERFACE (J6.9)
PC5: STM32_PINS (U1.U4), INTERFACE (J6.11)
PC8: STM32_PINS (U1.?20), INTERFACE (J6.13)
PD3: STM32_PINS (U1.?23), INTERFACE (J6.15)
PD4: STM32_PINS (U1.?24), INTERFACE (J6.17)
PD5: STM32_PINS (U1.?25), INTERFACE (J6.19)
PD11: STM32_PINS (U1.?26), INTERFACE (J6.21)
PD12: STM32_PINS (U1.D12), INTERFACE (J6.23)
PD13: STM32_PINS (U1.?27), INTERFACE (J6.25)
PE2: STM32_PINS (U1.?3), INTERFACE (J6.27)
PE3: STM32_PINS (U1.?4), INTERFACE (J6.29)
PE5: STM32_PINS (U1.?6), INTERFACE (J6.31)
PE6: STM32_PINS (U1.?7), INTERFACE (J6.33)
PG3: STM32_PINS (U1.?9), INTERFACE (J6.35)
PG7: STM32_PINS (U1.F16), INTERFACE (J6.37)
PG11: STM32_PINS (U1.B9), INTERFACE (J6.39)
PG12: STM32_PINS (U1.?11), INTERFACE (J7.40)
PG13: STM32_PINS (U1.D9), INTERFACE (J7.38)
PG14: STM32_PINS (U1.D8), INTERFACE (J7.36)
PH2: STM32_PINS (U1.N2), INTERFACE (J7.34)
PH3: STM32_PINS (U1.P2), INTERFACE (J7.32)
PH6: STM32_PINS (U1.T11), INTERFACE (J7.30)
PH7: STM32_PINS (U1.U13), INTERFACE (J7.28)
PH9: STM32_PINS (U1.R13), INTERFACE (J7.26)
PH10: STM32_PINS (U1.P13), INTERFACE (J7.24)
PH11: STM32_PINS (U1.P14), INTERFACE (J7.22)
PH12: STM32_PINS (U1.R14), INTERFACE (J7.20)
PH13: STM32_PINS (U1.D16), INTERFACE (J7.18)
PH14: STM32_PINS (U1.B17), INTERFACE (J7.16)
PH15: STM32_PINS (U1.B16), INTERFACE (J7.14)
PI0: STM32_PINS (U1.?1), INTERFACE (J7.12)
PI1: STM32_PINS (U1.A15), INTERFACE (J7.10)
PI2: STM32_PINS (U1.B15), INTERFACE (J7.8)
PI3: STM32_PINS (U1.C14), INTERFACE (J7.6)
PI5: STM32_PINS (U1.A3), INTERFACE (J7.4)
PI8: STM32_PINS (U1.?5), INTERFACE (J7.2)
PI9: STM32_PINS (U1.?6), INTERFACE (J7.1)
PI10: STM32_PINS (U1.?7), INTERFACE (J7.3)
PI11: STM32_PINS (U1.?8), INTERFACE (J7.5)
QSPI  BK1  IO0: STM32_PINS (U1.K4), Store (U6.5)
QSPI  BK1  IO1: STM32_PINS (U1.L4), Store (U6.2)
QSPI  BK1  IO2: STM32_PINS (U1.K3), Store (U6.3)
QSPI  BK1  IO3: STM32_PINS (U1.K2), Store (U6.7)
QSPI  BK1  NCS: STM32_PINS (U1.G15), Store (R18.2 U6.1)
QSPI BK1 CLK: STM32_PINS (U1.R6), Store (U6.6)
SDMMC2 CK: STM32_PINS (U1.B11), Store (SD1.5)
SDMMC2 CMD: STM32_PINS (U1.C11), Store (R21.1 SD1.3)
SDMMC2 D0: STM32_PINS (U1.U15), Store (R22.1 SD1.7)
SDMMC2 D1: STM32_PINS (U1.T15), Store (R23.1 SD1.8)
SDMMC2 D2: STM32_PINS (U1.C6), Store (R19.1 SD1.1)
SDMMC2 D3: STM32_PINS (U1.B7), Store (R20.1 SD1.2)
USART1 RX: STM32_PINS (U1.D14), INTERFACE (J2.2)
USART1 TX: STM32_PINS (U1.D15), INTERFACE (J2.1)
USART3 TX: STM32_PINS (U1.A13 U1.B13), INTERFACE (J3.1)
USART5 RX: STM32_PINS (U1.?22), INTERFACE (J4.2)
USART5 TX: STM32_PINS (U1.C12), INTERFACE (J4.1)
USB  DM: STM32_PINS (U1.E17), stm32_vcc (U2.A7 U2.B7)
USB  DP: STM32_PINS (U1.E16), stm32_vcc (U2.A6 U2.B6)